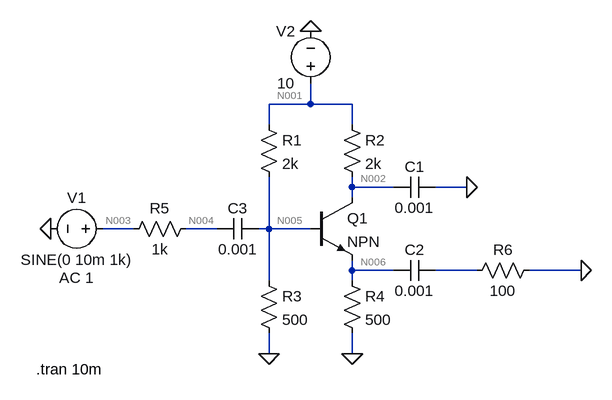
[diagram p0: schematic CC.asc]
CC.asc, the LTspice schematic file:
Version 4
SHEET 1 880 680
WIRE 176 -80 176 -112
WIRE 176 -80 112 -80
WIRE 240 -80 176 -80
WIRE 112 -48 112 -80
WIRE 240 -48 240 -80
WIRE 240 48 240 32
WIRE 304 48 240 48
WIRE 416 48 368 48
WIRE 240 64 240 48
WIRE -96 112 -144 112
WIRE 32 112 -16 112
WIRE 112 112 112 32
WIRE 112 112 96 112
WIRE 176 112 112 112
WIRE 240 176 240 160
WIRE 304 176 240 176
WIRE 432 176 368 176
WIRE 592 176 512 176
WIRE 112 192 112 112
WIRE 240 192 240 176
WIRE 112 304 112 272
WIRE 240 304 240 272
FLAG 112 304 0
FLAG 240 304 0
FLAG 176 -192 0
FLAG 416 48 0
FLAG -224 112 0
FLAG 592 176 0
SYMBOL res 96 -64 R0
SYMATTR InstName R1
SYMATTR Value 2k
SYMBOL res 224 -64 R0
SYMATTR InstName R2
SYMATTR Value 2k
SYMBOL res 96 176 R0
SYMATTR InstName R3
SYMATTR Value 500
SYMBOL res 224 176 R0
SYMATTR InstName R4
SYMATTR Value 500
SYMBOL npn 176 64 R0
SYMATTR InstName Q1
SYMBOL cap 368 32 R90
WINDOW 0 0 32 VBottom 2
WINDOW 3 32 32 VTop 2
SYMATTR InstName C1
SYMATTR Value 0.001
SYMBOL cap 368 160 R90
WINDOW 0 0 32 VBottom 2
WINDOW 3 32 32 VTop 2
SYMATTR InstName C2
SYMATTR Value 0.001
SYMBOL cap 96 96 R90
WINDOW 0 0 32 VBottom 2
WINDOW 3 32 32 VTop 2
SYMATTR InstName C3
SYMATTR Value 0.001
SYMBOL voltage 176 -96 R180
WINDOW 0 24 96 Left 2
WINDOW 3 24 16 Left 2
WINDOW 123 0 0 Left 0
WINDOW 39 0 0 Left 0
SYMATTR InstName V2
SYMATTR Value 10
SYMBOL res 0 96 R90
WINDOW 0 0 56 VBottom 2
WINDOW 3 32 56 VTop 2
SYMATTR InstName R5
SYMATTR Value 1k
SYMBOL voltage -128 112 R90
WINDOW 0 -32 56 VBottom 2
WINDOW 3 32 56 VTop 2
WINDOW 123 60 56 VTop 2
WINDOW 39 0 0 Left 0
SYMATTR InstName V1
SYMATTR Value SINE(0 10m 1k)
SYMATTR Value2 AC 1
SYMBOL res 528 160 R90
WINDOW 0 0 56 VBottom 2
WINDOW 3 32 56 VTop 2
SYMATTR InstName R6
SYMATTR Value 100
TEXT -246 328 Left 2 !.tran 10m

The netlist it stands for:
* CC.asc
R1 N001 N005 2k
R2 N001 N002 2k
R3 N005 0 500
R4 N006 0 500
Q1 N002 N005 N006 0 NPN
C1 0 N002 0.001
C2 N007 N006 0.001
C3 N005 N004 0.001
V2 N001 0 10
R5 N004 N003 1k
V1 N003 0 SINE(0 10m 1k) AC 1
R6 0 N007 100
.model NPN NPN
.model PNP PNP
.lib standard.bjt
.tran 10m
.backanno
.end

* Results of the author's LTspice run, read from the files saved beside the schematic
* Operating Point, zero values left out:
*   V(n001) = 10 V
*   V(n005) = 1.991 V
*   V(n002) = 5.271 V
*   V(n006) = 1.194 V
*   Ic(Q1) = 2.364 mA
*   Ib(Q1) = 23.64 µA
*   Ie(Q1) = -2.388 mA
*   I(R4) = 2.388 mA
*   I(R3) = 3.981 mA
*   I(R2) = 2.364 mA
*   I(R1) = 4.005 mA
*   I(V2) = -6.369 mA
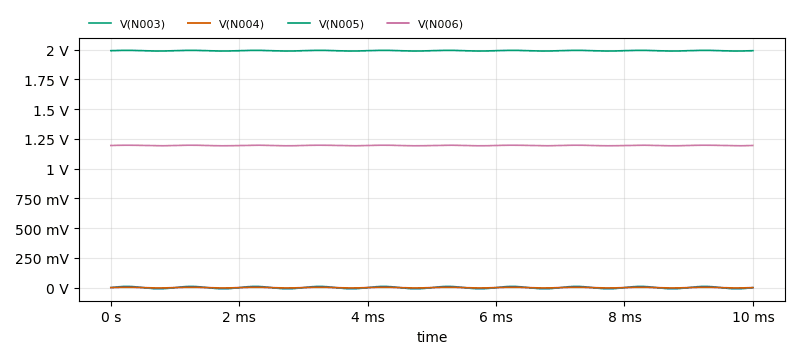
[diagram p1: Transient Analysis of CC.asc, plotted from the saved traces]
* Transient Analysis, 1 run:
*   V(N003): min -10 mV, max 10 mV, average -6.828 nV, rms 7.072 mV, last 0 V
*   V(N004): min -2.77 mV, max 2.772 mV, average 881.4 nV, rms 1.96 mV, last -20.05 nV
*   V(N005): min 1.988 V, max 1.993 V, average 1.991 V, rms 1.991 V, last 1.991 V
*   V(N006): min 1.192 V, max 1.197 V, average 1.194 V, rms 1.194 V, last 1.194 V